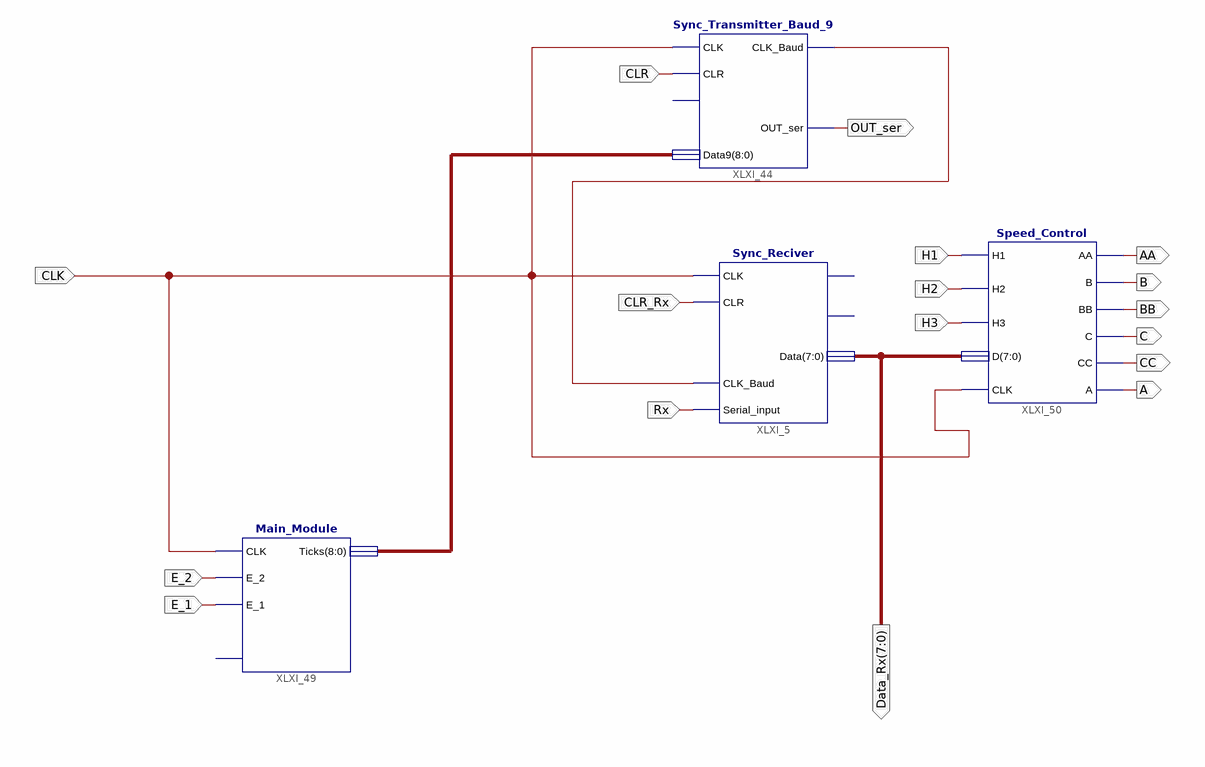
[diagram p0: schematic sheet 1]
// Xilinx ISE schematic Rough.sch (spartan6) as structural Verilog: 4 symbols, 17 ports
module Rough (
  input  CLR,
  input  CLR_Rx,
  input  CLK,
  input  Rx,
  input  E_2,
  input  E_1,
  input  H1,
  input  H2,
  input  H3,
  output OUT_ser,
  output [7:0] Data_Rx,
  output AA,
  output B,
  output BB,
  output C,
  output CC,
  output A
);

  wire XLXN_76;
  wire [8:0] XLXN_74;

  Sync_Transmitter_Baud_9 XLXI_44 (
    .CLK(CLK), .CLR(CLR), .Data9(XLXN_74), .CLK_Baud(XLXN_76), .OUT_ser(OUT_ser));  // open: RST
  Sync_Reciver XLXI_5 (
    .CLK(CLK), .CLR(CLR_Rx), .CLK_Baud(XLXN_76), .Serial_input(Rx), .Data(Data_Rx));  // open: Data_Ready, Parity_ERR
  Main_Module XLXI_49 (.CLK(CLK), .E_2(E_2), .E_1(E_1), .Ticks(XLXN_74));  // open: RST_1
  Speed_Control XLXI_50 (
    .H1(H1), .H2(H2), .H3(H3), .D(Data_Rx), .CLK(CLK), .AA(AA), .BB(BB), .CC(CC), .A(A), .C(C), .B(B));
endmodule
